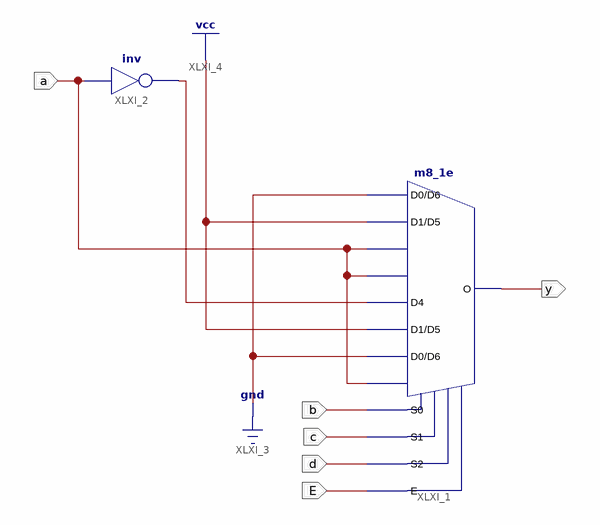
[diagram p0: schematic sheet 1]
// Xilinx ISE schematic UKOL4.sch (spartan6) as structural Verilog: 2 symbols, 6 ports
module UKOL4 (
  input  E,
  input  d,
  input  c,
  input  b,
  input  a,
  output y
);

  wire XLXN_17;

  m8_1e XLXI_1 (
    .D0(1'b0), .D1(1'b1), .D2(a), .D3(a), .D4(XLXN_17), .D5(1'b1), .D6(1'b0), .D7(a), .E(E), .S0(b), .S1(c),
    .S2(d), .O(y));
  not XLXI_2 (XLXN_17, a);
endmodule
